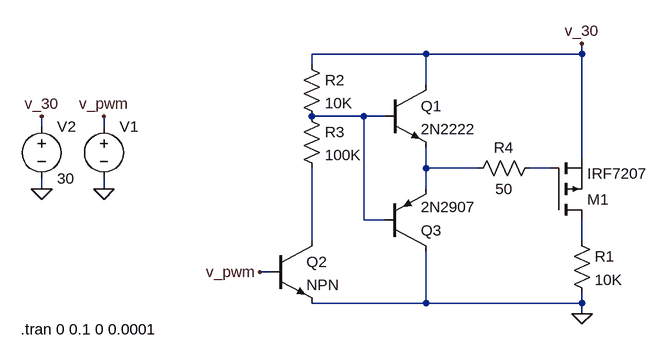
[diagram p0: schematic main.asc]
main.asc, the LTspice schematic file:
Version 4
SHEET 1 1140 680
WIRE 784 -400 608 -400
WIRE 1024 -400 1024 -416
WIRE 1024 -400 784 -400
WIRE 608 -384 608 -400
WIRE 784 -352 784 -400
WIRE 688 -304 608 -304
WIRE 720 -304 688 -304
WIRE 192 -288 192 -304
WIRE 288 -288 288 -304
WIRE 1024 -240 1024 -400
WIRE 784 -224 784 -256
WIRE 864 -224 784 -224
WIRE 976 -224 944 -224
WIRE 192 -192 192 -208
WIRE 288 -192 288 -208
WIRE 784 -192 784 -224
WIRE 688 -144 688 -304
WIRE 720 -144 688 -144
WIRE 608 -112 608 -224
WIRE 1024 -112 1024 -144
WIRE 544 -64 528 -64
WIRE 784 -16 784 -96
WIRE 784 -16 608 -16
WIRE 1024 -16 1024 -32
WIRE 1024 -16 784 -16
WIRE 1024 0 1024 -16
FLAG 192 -192 0
FLAG 288 -192 0
FLAG 192 -304 v_30
FLAG 288 -304 v_pwm
FLAG 1024 0 0
FLAG 1024 -416 v_30
FLAG 528 -64 v_pwm
SYMBOL voltage 288 -304 R0
WINDOW 3 24 96 Invisible 2
WINDOW 123 0 0 Left 2
WINDOW 39 0 0 Left 2
SYMATTR Value PULSE(0 5 0 0.0000000001 0.000000001 0.001 0.002 1000)
SYMATTR InstName V1
SYMBOL voltage 192 -304 R0
WINDOW 123 0 0 Left 2
WINDOW 39 0 0 Left 2
SYMATTR InstName V2
SYMATTR Value 30
SYMBOL pmos 976 -144 M180
SYMATTR InstName M1
SYMATTR Value IRF7207
SYMBOL res 1008 -128 R0
SYMATTR InstName R1
SYMATTR Value 10K
SYMBOL npn 720 -352 R0
SYMATTR InstName Q1
SYMATTR Value 2N2222
SYMBOL npn 544 -112 R0
SYMATTR InstName Q2
SYMBOL pnp 720 -96 M180
SYMATTR InstName Q3
SYMATTR Value 2N2907
SYMBOL res 592 -400 R0
SYMATTR InstName R2
SYMATTR Value 10K
SYMBOL res 592 -320 R0
SYMATTR InstName R3
SYMATTR Value 100K
SYMBOL res 960 -240 R90
WINDOW 0 0 56 VBottom 2
WINDOW 3 32 56 VTop 2
SYMATTR InstName R4
SYMATTR Value 50
TEXT 160 24 Left 2 !.tran 0 0.1 0 0.0001

The netlist it stands for:
* main.asc
V1 v_pwm 0 PULSE(0 5 0 0.0000000001 0.000000001 0.001 0.002 1000)
V2 v_30 0 30
M1 N005 N003 v_30 v_30 IRF7207
R1 N005 0 10K
Q1 v_30 N001 N002 0 2N2222
Q2 N004 v_pwm 0 0 NPN
Q3 0 N001 N002 0 2N2907
R2 v_30 N001 10K
R3 N001 N004 100K
R4 N003 N002 50
.model NPN NPN
.model PNP PNP
.lib standard.bjt
.model NMOS NMOS
.model PMOS PMOS
.lib standard.mos
.tran 0 0.1 0 0.0001
.backanno
.end